# EAGLE design Multiplexed_PMP (EAGLE 7.6.0)
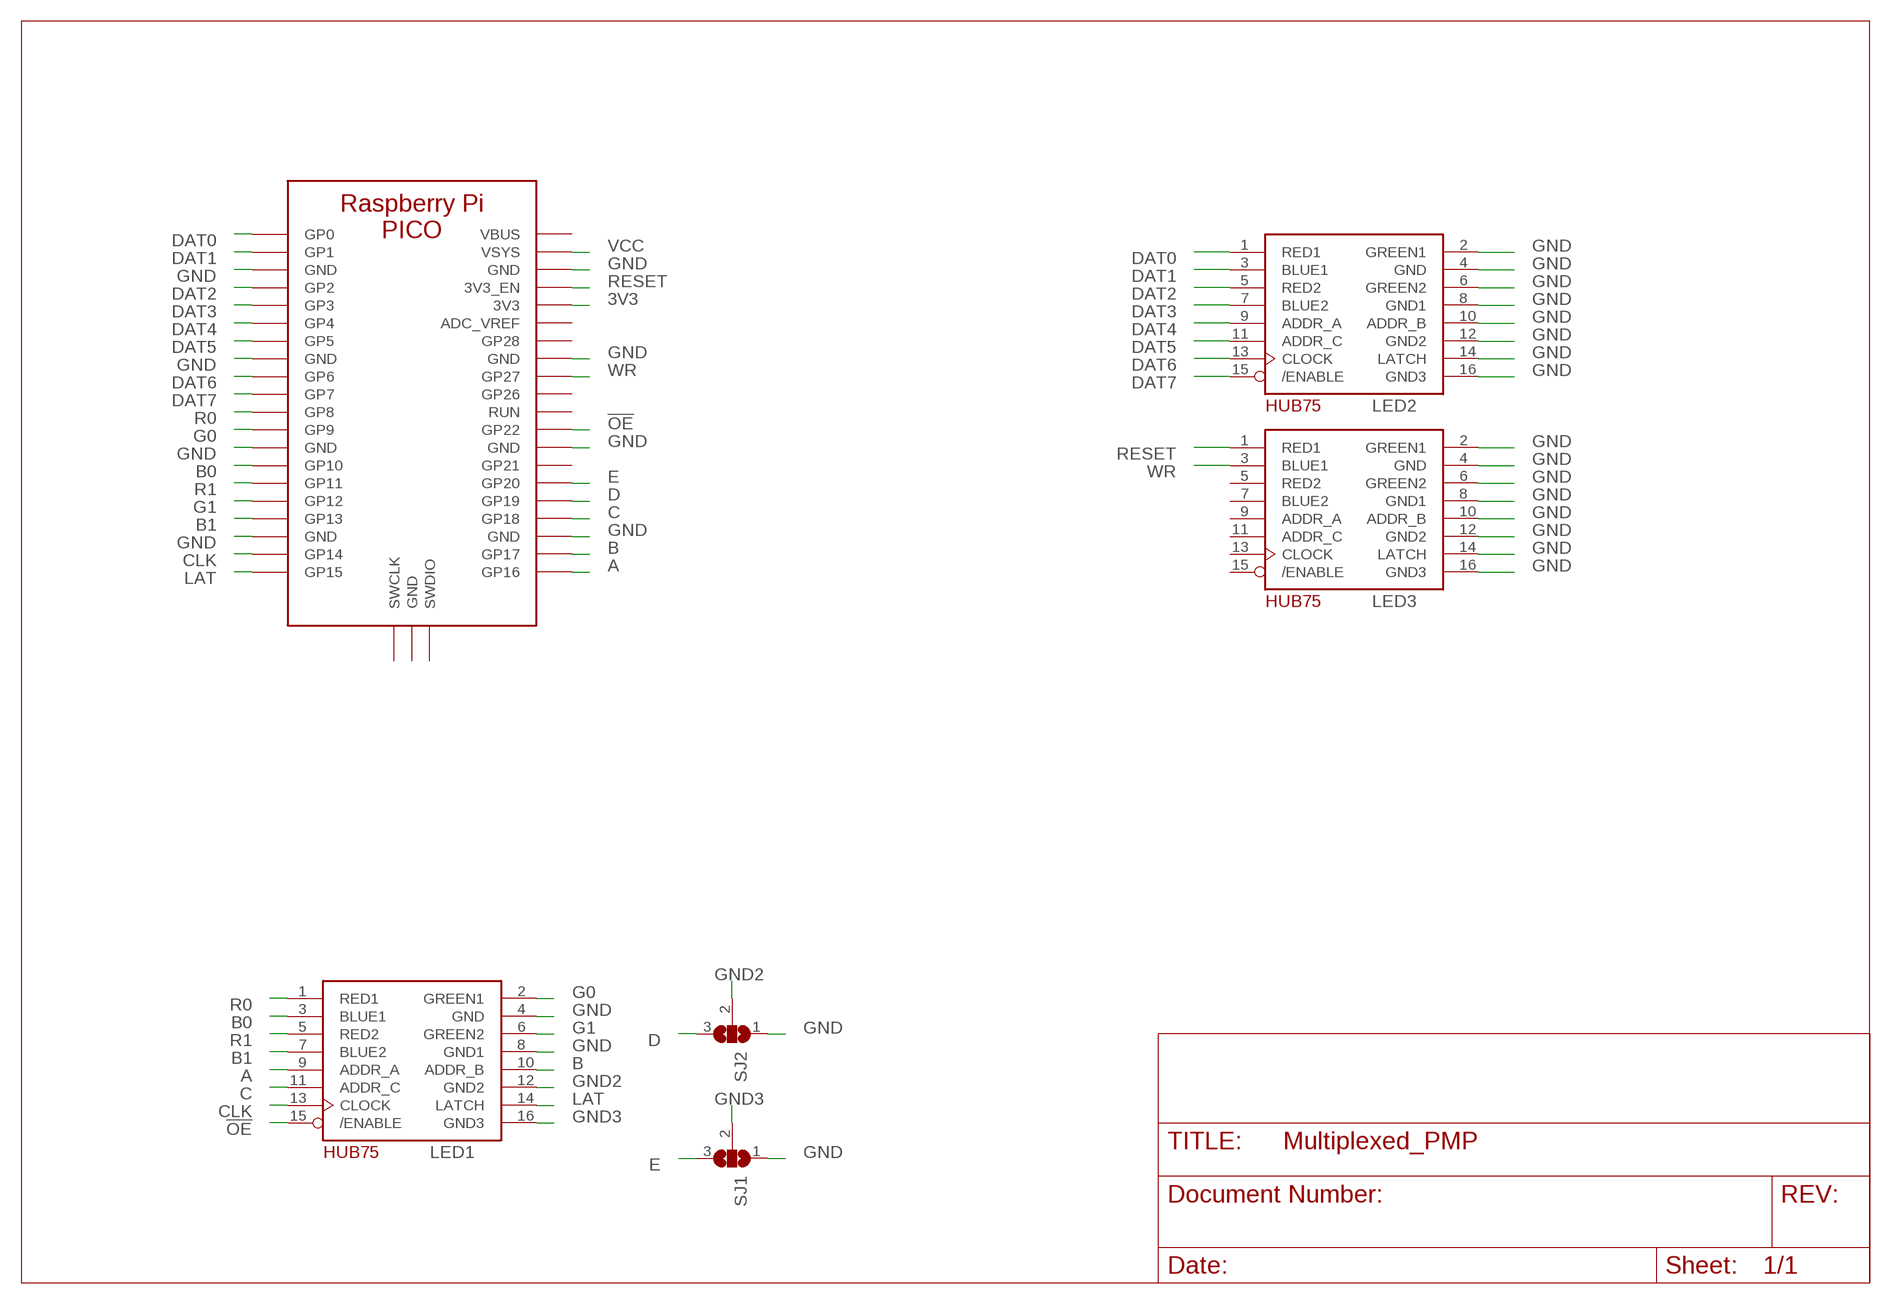
[diagram p0: schematic, sheet 1]

## Parts
LED1  HUB75MATRIX  [2X08-IDC]
LED2  HUB75MATRIX  [2X08-IDC]
LED3  HUB75MATRIX  [2X08-IDC]
SJ1  SJ2W  [SJ_2]
SJ2  SJ2W  [SJ_2]
U$1  PICO  [PICO]

## Nets
3V3: U$1.P$3V3(3V3)
!OE: LED1.15(/ENABLE) U$1.P$GP22(GP22)
A: LED1.9(ADDR_A) U$1.P$GP16(GP16)
B: LED1.10(ADDR_B) U$1.P$GP17(GP17)
B0: LED1.3(BLUE1) U$1.P$GP10(GP10)
B1: LED1.7(BLUE2) U$1.P$GP13(GP13)
C: LED1.11(ADDR_C) U$1.P$GP18(GP18)
CLK: LED1.13(CLOCK) U$1.P$GP14(GP14)
D: SJ2.3 U$1.P$GP19(GP19)
DAT0: LED2.1(RED1) U$1.P$GP0(GP0)
DAT1: LED2.3(BLUE1) U$1.P$GP1(GP1)
DAT2: LED2.5(RED2) U$1.P$GP2(GP2)
DAT3: LED2.7(BLUE2) U$1.P$GP3(GP3)
DAT4: LED2.9(ADDR_A) U$1.P$GP4(GP4)
DAT5: LED2.11(ADDR_C) U$1.P$GP5(GP5)
DAT6: LED2.13(CLOCK) U$1.P$GP6(GP6)
DAT7: LED2.15(/ENABLE) U$1.P$GP7(GP7)
E: SJ1.3 U$1.P$GP20(GP20)
G0: LED1.2(GREEN1) U$1.P$GP9(GP9)
G1: LED1.6(GREEN2) U$1.P$GP12(GP12)
GND: LED1.4(GND) LED1.8(GND1) LED2.2(GREEN1) LED2.4(GND) LED2.6(GREEN2) LED2.8(GND1) LED2.10(ADDR_B) LED2.12(GND2) LED2.14(LATCH) LED2.16(GND3) LED3.2(GREEN1) LED3.4(GND) LED3.6(GREEN2) LED3.8(GND1) LED3.10(ADDR_B) LED3.12(GND2) LED3.14(LATCH) LED3.16(GND3) SJ1.1 SJ2.1 U$1.P$GND3(GND) U$1.P$GND8(GND) U$1.P$GND13(GND) U$1.P$GND18(GND) U$1.P$GND23(GND) U$1.P$GND28(GND) U$1.P$GND33(GND) U$1.P$GND38(GND)
GND2: LED1.12(GND2) SJ2.2
GND3: LED1.16(GND3) SJ1.2
LAT: LED1.14(LATCH) U$1.P$GP15(GP15)
R0: LED1.1(RED1) U$1.P$GP8(GP8)
R1: LED1.5(RED2) U$1.P$GP11(GP11)
RESET: LED3.1(RED1) U$1.P$3V3_EN(3V3_EN)
VCC: U$1.P$VSYNC(VSYS)
WR: LED3.3(BLUE1) U$1.P$GP27(GP27)
Unconnected: LED3.5(RED2) LED3.7(BLUE2) LED3.9(ADDR_A) LED3.11(ADDR_C) LED3.13(CLOCK) LED3.15(/ENABLE) U$1.P$GP21(GP21) U$1.P$GP26(GP26) U$1.P$GP28(GP28) U$1.P$RUN(RUN) U$1.P$SWCLK(SWCLK) U$1.P$SWDIO(SWDIO)

## Power pins joined to a net without a drawn wire
ADC_VREF: U$1.P$ADC_VREF(ADC_VREF)
GND: U$1.P$GND(GND)
VBUS: U$1.P$VBUS(VBUS)

## Library data of the parts
LED1-LED3 = adafruit:HUB75MATRIX
SJ1 SJ2 = jumper:SJ2W: SMD solder JUMPER
U$1 = Raspberry_Pi_Pico:PICO

## Board
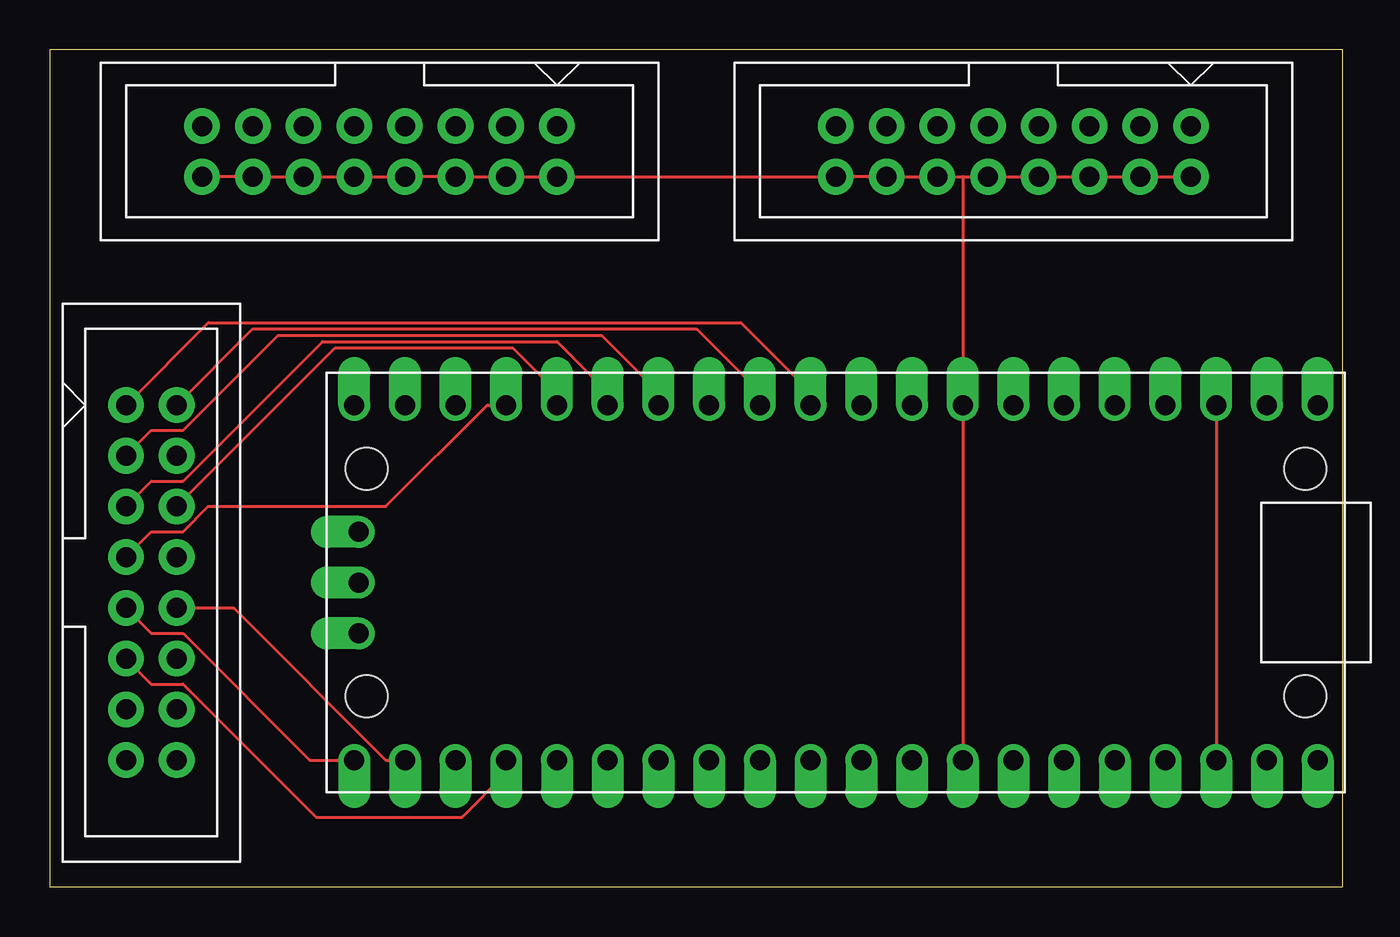
[diagram p1: board, top side]
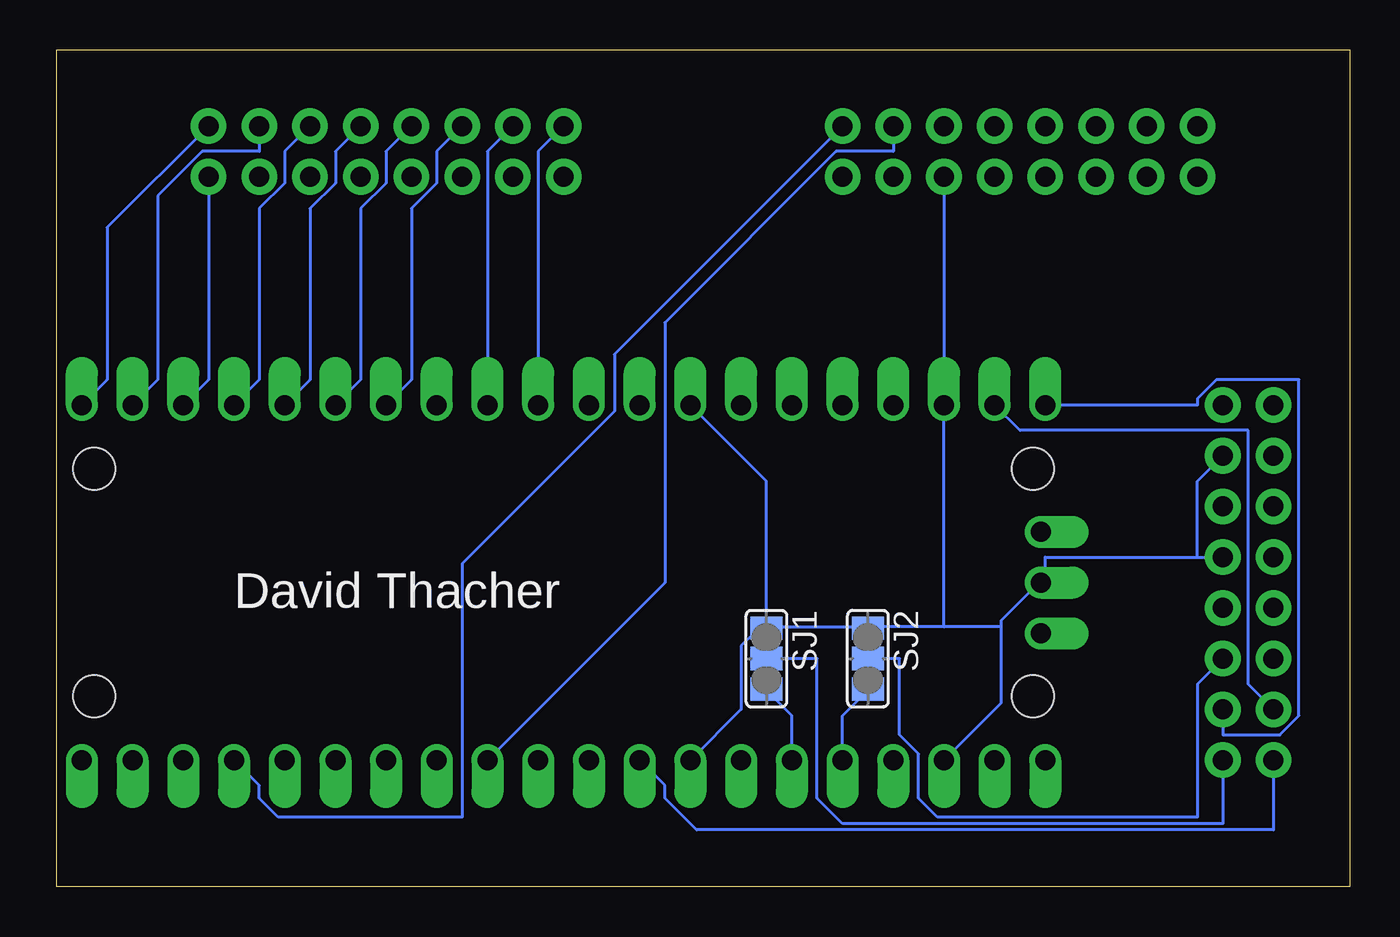
[diagram p2: board, bottom side, seen from below]

Size 64.77 x 41.91 mm. Coordinates in mm from the lower left corner, seen from the top.
Outline: 0,0 64.77,0 64.77,41.91 0,41.91 0,0
Copper layers (1*16): Top 0.0356mm / dielectric 1.5011mm / Bottom 0.0356mm
Design rules "oshpark-2layer": minimum track width 6mil, minimum drill 13mil, track to track 6mil, track to pad 6mil, pad to pad 6mil, via to via 6mil, smd to smd 6mil, copper to edge 15mil, drill to drill 6mil, minimum pad ring 7mil, minimum via ring 7mil, stop-mask expansion 2.5mil, vias tented up to drill 0mil, thermal gap 10mil

### Footprints (pad centres in the part's own frame; a part is rotated, then mirrored left to right if it is on the bottom)
2X08-IDC = drill 1 pad 1.778: 1 -1.27,8.89; 2 1.27,8.89; 3 -1.27,6.35; 4 1.27,6.35; 5 -1.27,3.81; 6 1.27,3.81; 7 -1.27,1.27; 8 1.27,1.27; 9 -1.27,-1.27; 10 1.27,-1.27; 11 -1.27,-3.81; 12 1.27,-3.81; 13 -1.27,-6.35; 14 1.27,-6.35; 15 -1.27,-8.89; 16 1.27,-8.89
SJ_2 = smd 1.168 x 1.6: 1 -1.524,0; 2 0,0; 3 1.524,0
PICO = drill 1 pad 1.6 offset: P$3V3 8.89,13.97; P$3V3_EN 8.89,16.51; P$ADC_VREF 8.89,11.43; P$GND 0,-23.9; P$GND3 -8.89,19.05; P$GND8 -8.89,6.35; P$GND13 -8.89,-6.35; P$GND18 -8.89,-19.05; P$GND23 8.89,-19.05; P$GND28 8.89,-6.35; P$GND33 8.89,6.35; P$GND38 8.89,19.05; P$GP0 -8.89,24.13; P$GP1 -8.89,21.59; P$GP2 -8.89,16.51; P$GP3 -8.89,13.97; P$GP4 -8.89,11.43; P$GP5 -8.89,8.89; P$GP6 -8.89,3.81; P$GP7 -8.89,1.27; P$GP8 -8.89,-1.27; P$GP9 -8.89,-3.81; P$GP10 -8.89,-8.89; P$GP11 -8.89,-11.43; P$GP12 -8.89,-13.97; P$GP13 -8.89,-16.51; P$GP14 -8.89,-21.59; P$GP15 -8.89,-24.13; P$GP16 8.89,-24.13; P$GP17 8.89,-21.59; P$GP18 8.89,-16.51; P$GP19 8.89,-13.97; P$GP20 8.89,-11.43; P$GP21 8.89,-8.89; P$GP22 8.89,-3.81; P$GP26 8.89,1.27; P$GP27 8.89,3.81; P$GP28 8.89,8.89; P$RUN 8.89,-1.27; P$SWCLK -2.54,-23.9; P$SWDIO 2.54,-23.9; P$VBUS 8.89,24.13; P$VSYNC 8.89,21.59 | hole 2.1: -5.7,-23.5; 5.7,-23.5; 5.7,23.5; -5.7,23.5

### Placement (x,y rotation side)
LED1  5.08,15.24 0 top
LED2  48.26,36.83 270 top
LED3  16.51,36.83 270 top
SJ1  29.21,11.43 270 bottom
SJ2  24.13,11.43 270 bottom
U$1  39.37,15.24 270 top

### Tracks (layer width: path | path; a pad name or v marks a point on that pad's centre or on a via)
!OE
  Bottom 0.152: U$1.P$GP22 34.29,5.08 34.29,4.45 32.7,2.86 3.81,2.86 LED1.15
A
  Top 0.152: U$1.P$GP16 13.02,6.35 6.67,12.7 5.08,12.7 LED1.9
B
  Top 0.152: U$1.P$GP17 16.83,6.35 9.21,13.97 LED1.10
B0
  Top 0.152: U$1.P$GP10 30.48,24.77 27.62,27.62 11.43,27.62 6.67,22.86 5.08,22.86 LED1.3
B1
  Top 0.152: U$1.P$GP13 21.91,24.13 16.83,19.05 7.94,19.05 6.67,17.78 5.08,17.78 LED1.7
C
  Top 0.152: U$1.P$GP18 22.86,5.71 20.64,3.49 13.34,3.49 6.67,10.16 5.08,10.16 LED1.11
CLK
  Bottom 0.152: U$1.P$GP14 16.51,22.86 5.08,22.86 5.08,10.16 LED1.13
D
  Bottom 0.152: U$1.P$GP19 25.4,8.57 24.13,9.84 SJ2.3
DAT0
  Bottom 0.152: U$1.P$GP0 62.23,25.4 62.23,33.02 LED2.1
DAT1
  Bottom 0.152: U$1.P$GP1 59.69,25.4 59.69,34.61 57.47,36.83 54.61,36.83 LED2.3
DAT2
  Bottom 0.152: U$1.P$GP2 54.61,25.4 54.61,33.97 53.34,35.24 53.34,36.83 LED2.5
DAT3
  Bottom 0.152: U$1.P$GP3 52.07,25.4 52.07,33.97 50.8,35.24 50.8,36.83 LED2.7
DAT4
  Bottom 0.152: U$1.P$GP4 49.53,25.4 49.53,33.97 48.26,35.24 48.26,36.83 LED2.9
DAT5
  Bottom 0.152: U$1.P$GP5 46.99,25.4 46.99,33.97 45.72,35.24 45.72,36.83 LED2.11
DAT6
  Bottom 0.152: U$1.P$GP6 43.18,36.83 LED2.13
DAT7
  Bottom 0.152: U$1.P$GP7 40.64,36.83 LED2.15
E
  Bottom 0.152: U$1.P$GP20 27.94,8.57 29.21,9.84 SJ1.3
G0
  Top 0.152: U$1.P$GP9 35.56,24.77 32.38,27.94 10.16,27.94 LED1.2
G1
  Top 0.152: U$1.P$GP12 25.4,24.77 23.18,26.99 14.29,26.99 LED1.6
GND
  Top 0.152: U$1.P$GND3 U$1.P$GND38 | U$1.P$GND33 U$1.P$GND8 45.72,35.56 | 45.72,35.56 LED2.12 LED2.14 LED2.16 LED3.2 LED3.4 LED3.6 LED3.8 LED3.10 LED3.12 LED3.14 LED3.16 | 45.72,35.56 LED2.10 LED2.8 LED2.6 LED2.4 LED2.2
  Bottom 0.152: U$1.P$GND3 57.15,25.4 LED2.2 | LED3.6 U$1.P$GND18 20.32,13.02 | 29.21,13.02 24.13,13.02 | U$1.P$GND28 30.48,8.89 30.48,12.06 29.84,12.7 29.21,12.7 SJ1.1 29.21,13.02 | U$1.P$GND13 29.21,20.32 29.21,13.02 | U$1.P$GND23 17.46,9.21 17.46,13.02 | 17.46,13.02 17.46,13.34 15.56,15.24 U$1.P$GND 15.24,15.24 15.24,16.51 7.62,16.51 | 7.62,16.51 LED1.8 | LED1.4 7.62,20.32 7.62,16.51 | 17.46,13.02 20.32,13.02 | 20.32,13.02 24.13,13.02 | 24.13,13.02 SJ2.1
GND2
  Bottom 0.152: SJ2.2 22.54,11.43 22.54,7.62 21.59,6.67 21.59,4.45 20.64,3.49 7.62,3.49 7.62,10.16 LED1.12
GND3
  Bottom 0.152: SJ1.2 26.67,11.43 26.67,4.45 25.4,3.17 6.35,3.17 LED1.16
LAT
  Bottom 0.152: U$1.P$GP15 7.62,24.13 7.62,24.45 6.67,25.4 2.54,25.4 2.54,8.57 3.49,7.62 6.35,7.62 LED1.14
R0
  Top 0.152: U$1.P$GP8 38.1,24.77 34.61,28.26 7.94,28.26 LED1.1
R1
  Top 0.152: U$1.P$GP11 27.94,24.77 25.4,27.3 13.65,27.3 6.67,20.32 5.08,20.32 LED1.5
RESET
  Bottom 0.152: U$1.P$3V3_EN 54.61,5.08 54.61,4.45 53.66,3.49 44.45,3.49 44.45,16.19 36.83,23.81 36.83,26.67 LED3.1
WR
  Bottom 0.152: U$1.P$GP27 34.29,15.24 34.29,28.26 25.72,36.83 22.86,36.83 LED3.3

### Text on the board
bNames: David Thacher